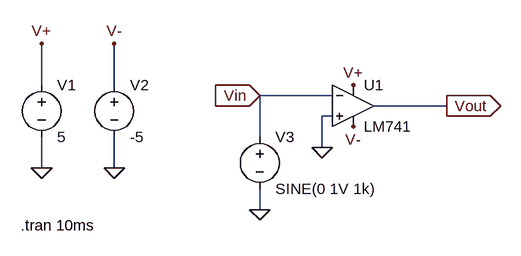
[diagram p0: schematic Task 1 – Open-Loop Op-Amp (Comparator).asc]
Task 1 – Open-Loop Op-Amp (Comparator).asc, the LTspice schematic file:
Version 4.1
SHEET 1 880 680
WIRE -96 112 -96 48
WIRE 16 112 16 48
WIRE 352 128 240 128
WIRE 528 144 416 144
WIRE 352 160 336 160
WIRE 240 192 240 128
WIRE 336 208 336 160
WIRE -96 240 -96 192
WIRE 16 240 16 192
WIRE 240 304 240 272
FLAG -96 240 0
FLAG 16 240 0
FLAG 240 304 0
FLAG 336 208 0
FLAG 528 144 Vout
IOPIN 528 144 Out
FLAG 240 128 Vin
IOPIN 240 128 In
FLAG -96 48 V+
FLAG 16 48 V-
FLAG 384 112 V+
FLAG 384 176 V-
SYMBOL voltage -96 96 R0
SYMATTR InstName V1
SYMATTR Value 5
SYMBOL voltage 16 96 R0
SYMATTR InstName V2
SYMATTR Value -5
SYMBOL OpAmps\\LM741 384 80 R0
SYMATTR InstName U1
SYMBOL voltage 240 176 R0
WINDOW 123 0 0 Left 0
WINDOW 39 0 0 Left 0
SYMATTR InstName V3
SYMATTR Value SINE(0 1V 1k)
TEXT -128 328 Left 2 !.tran 10ms

The netlist it stands for:
* Task 1 – Open-Loop Op-Amp (Comparator).asc
V1 V+ 0 5
V2 V- 0 -5
X§U1 0 Vin V+ V- Vout LM741  ; pins In+ In- V+ V- OUT
V3 Vin 0 SINE(0 1V 1k)
.tran 10ms
.lib LM741.lib
.backanno
.end